# EAGLE design sensore_linea (EAGLE 7.2.0)
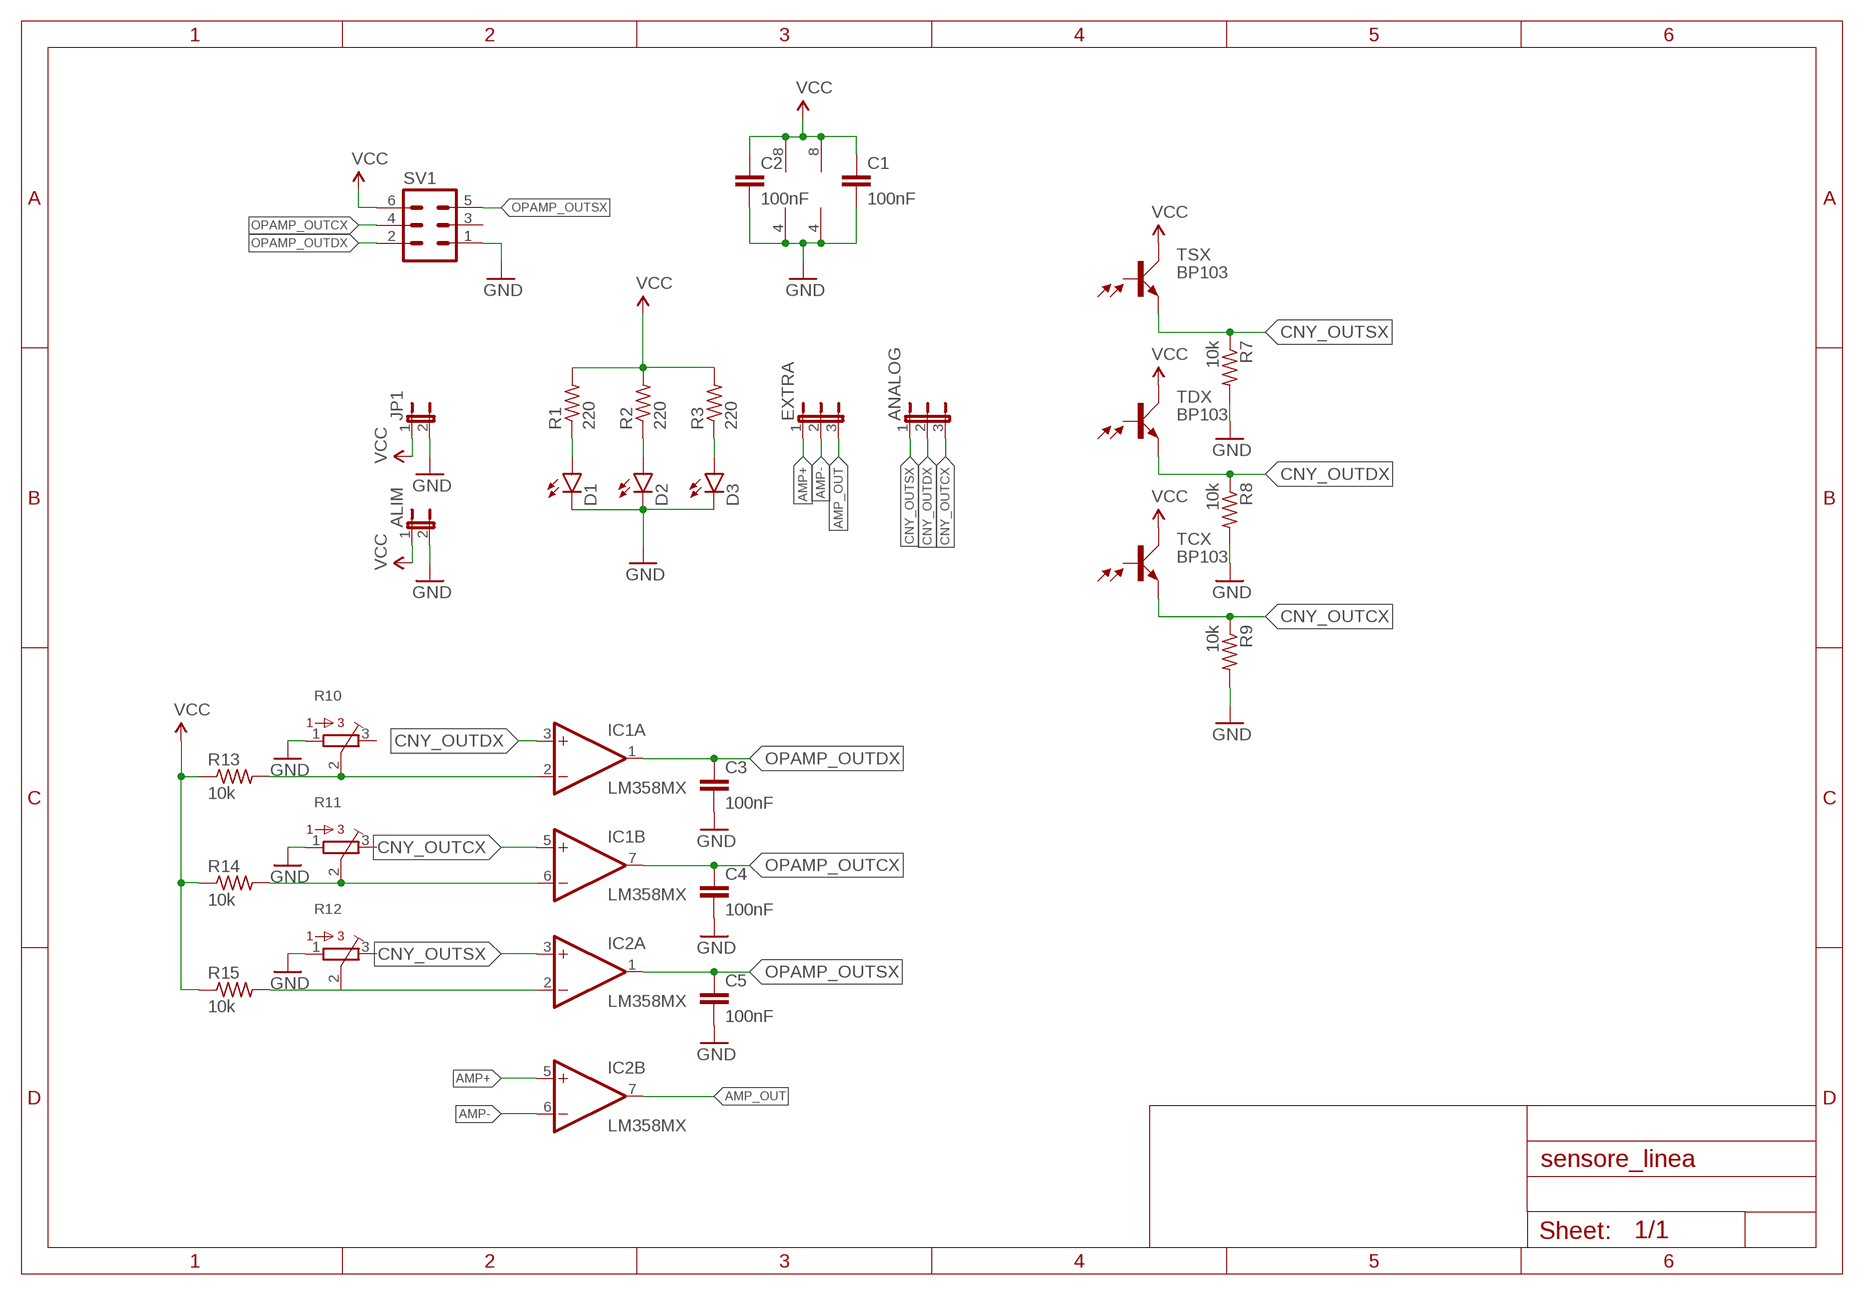
[diagram p0: schematic, sheet 1]

## Parts
ALIM  JP1E  [JP1]
ANALOG  JP2E  [JP2]
C1  100nF  C2.5/2  [C2.5-2]
C2  100nF  C2.5/2  [C2.5-2]
C3  100nF  C2.5/2  [C2.5-2]
C4  100nF  C2.5/2  [C2.5-2]
C5  100nF  C2.5/2  [C2.5-2]
D1  LED3MM  [LED3MM]
D2  LED3MM  [LED3MM]
D3  LED3MM  [LED3MM]
EXTRA  JP2E  [JP2]
IC1  LM358MX  [SO08]
IC2  LM358MX  [SO08]
JP1  JP1E  [JP1]
R1  220  R-US_0207/7  [0207/7]
R2  220  R-US_0207/7  [0207/7]
R3  220  R-US_0207/7  [0207/7]
R7  10k  R-US_0207/7  [0207/7]
R8  10k  R-US_0207/7  [0207/7]
R9  10k  R-US_0207/7  [0207/7]
R10  3386-J  [3386J]
R11  3386-J  [3386J]
R12  3386-J  [3386J]
R13  10k  R-US_0207/7  [0207/7]
R14  10k  R-US_0207/7  [0207/7]
R15  10k  R-US_0207/7  [0207/7]
SV1  MA03-2  [MA03-2]
TCX  BP103  [BP103]
TDX  BP103  [BP103]
TSX  BP103  [BP103]

## Nets
AMP+: EXTRA.1 IC2.5(B:+IN)
AMP-: EXTRA.2 IC2.6(B:-IN)
AMP_OUT: EXTRA.3 IC2.7(B:OUT)
CNY_OUTCX: ANALOG.3 IC1.5(B:+IN) R9.1 TCX.E
CNY_OUTDX: ANALOG.2 IC1.3(A:+IN) R8.1 TDX.E
CNY_OUTSX: ANALOG.1 IC2.3(A:+IN) R7.1 TSX.E
GND: ALIM.2 C1.2 C2.2 C3.2 C4.2 C5.2 D1.K(C) D2.K(C) D3.K(C) IC1.4(P:V-) IC2.4(P:V-) JP1.2 R7.2 R8.2 R9.2 R10.1 R11.1 R12.1 SV1.1
N$1: D1.A R1.1
N$2: D2.A R2.1
N$3: D3.A R3.1
N$10: IC1.2(A:-IN) R10.2 R13.2
N$11: IC1.6(B:-IN) R11.2 R14.2
N$12: IC2.2(A:-IN) R12.2 R15.2
OPAMP_OUTCX: C4.1 IC1.7(B:OUT) SV1.4
OPAMP_OUTDX: C3.1 IC1.1(A:OUT) SV1.2
OPAMP_OUTSX: C5.1 IC2.1(A:OUT) SV1.5
VCC: ALIM.1 C1.1 C2.1 IC1.8(P:V+) IC2.8(P:V+) JP1.1 R1.2 R2.2 R3.2 R13.1 R14.1 R15.1 SV1.6 TCX.C TDX.C TSX.C
Unconnected: R10.3 R11.3 R12.3 SV1.3 TCX.B TDX.B TSX.B

## Library data of the parts
ALIM JP1 = jumper:JP1E: JUMPER
ANALOG EXTRA = jumper:JP2E: JUMPER
C1-C5 = capacitor-wima:C: CAPACITOR naming: grid - package width
D1-D3 = SparkFun-LED:LED: LEDs Standard schematic elements and footprints for 5mm, 3mm, 1206, and 0603 sized LEDs. 5mm - Spark Fun Electronics SKU : COM-00529 (and others)
IC1 IC2 = linear:LM358: OP AMP also LM158; LM258; LM2904 Source: http://cache.national.com/ds/LM/LM158.pdf
R1-R3 R7-R9 R13-R15 = rcl:R-US_: RESISTOR, American symbol
R10-R12 = bourns:3386-: 3386 Series 3/8" Square Trimmer
SV1 = con-lstb:MA03-2: PIN HEADER; OC_FARNELL: unknown; OC_NEWARK: unknown
TCX TDX TSX = opto-trans-siemens:BP103: PHOTO TRANSISTOR; OC_FARNELL: unknown; OC_NEWARK: unknown

## Board
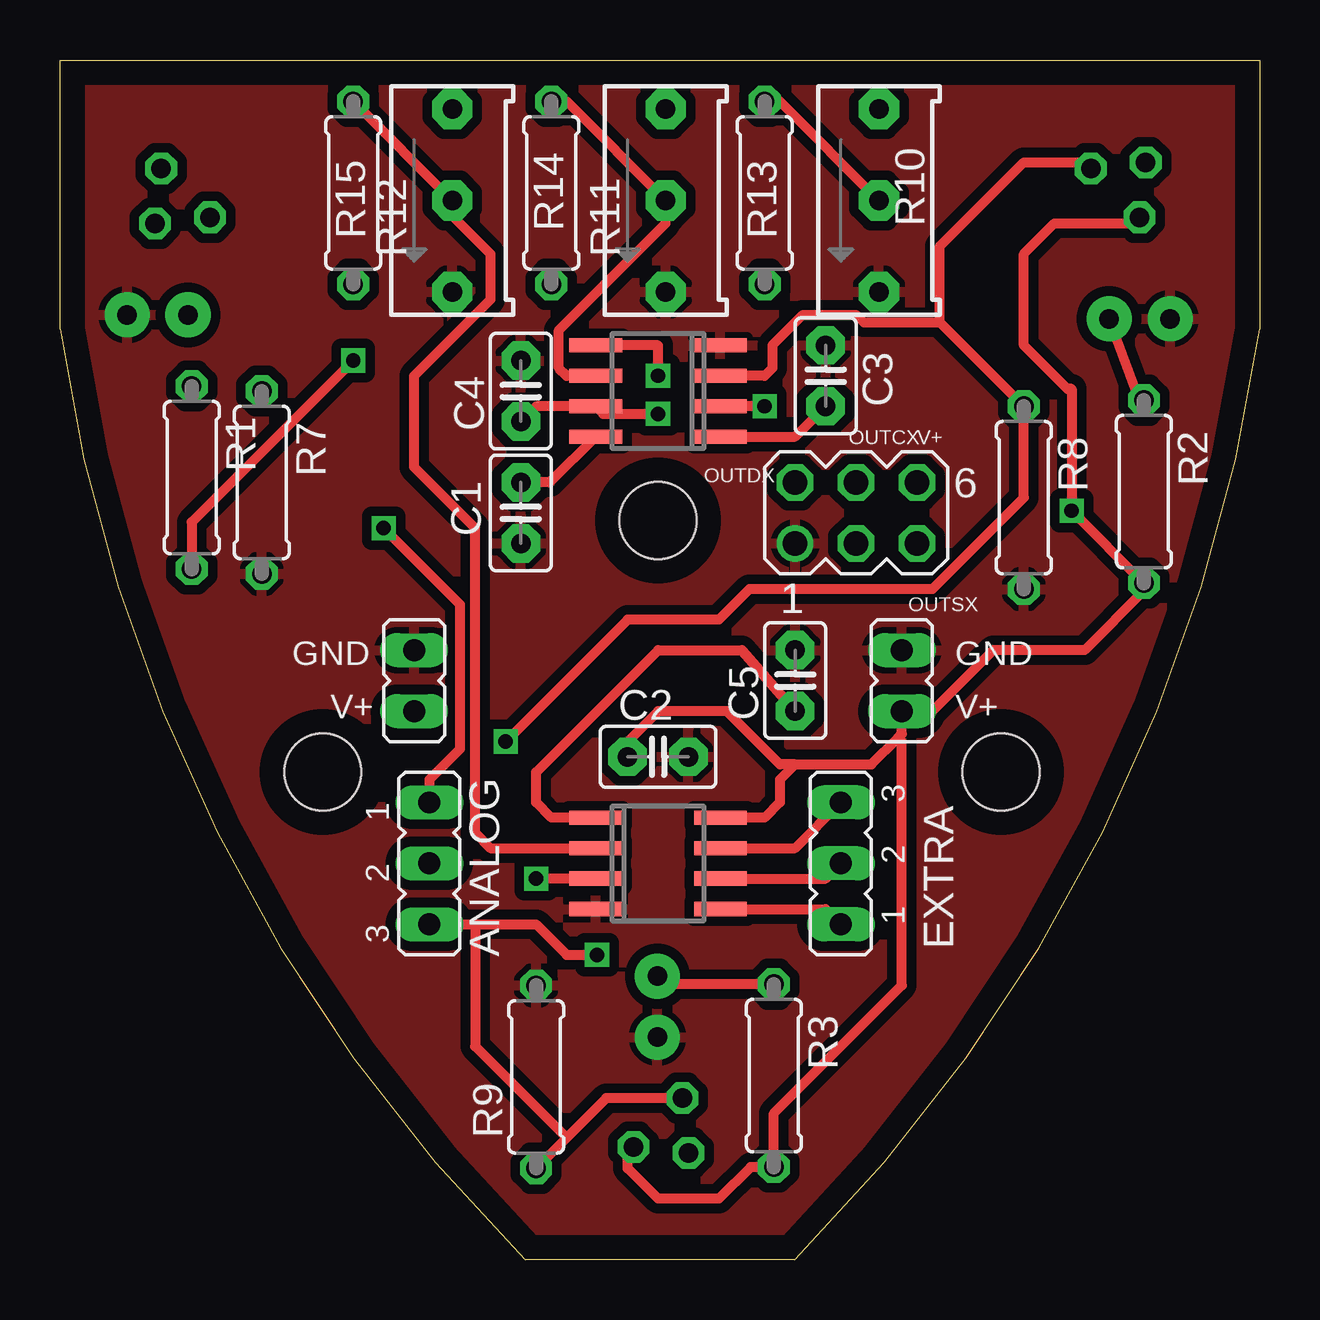
[diagram p1: board, top side]
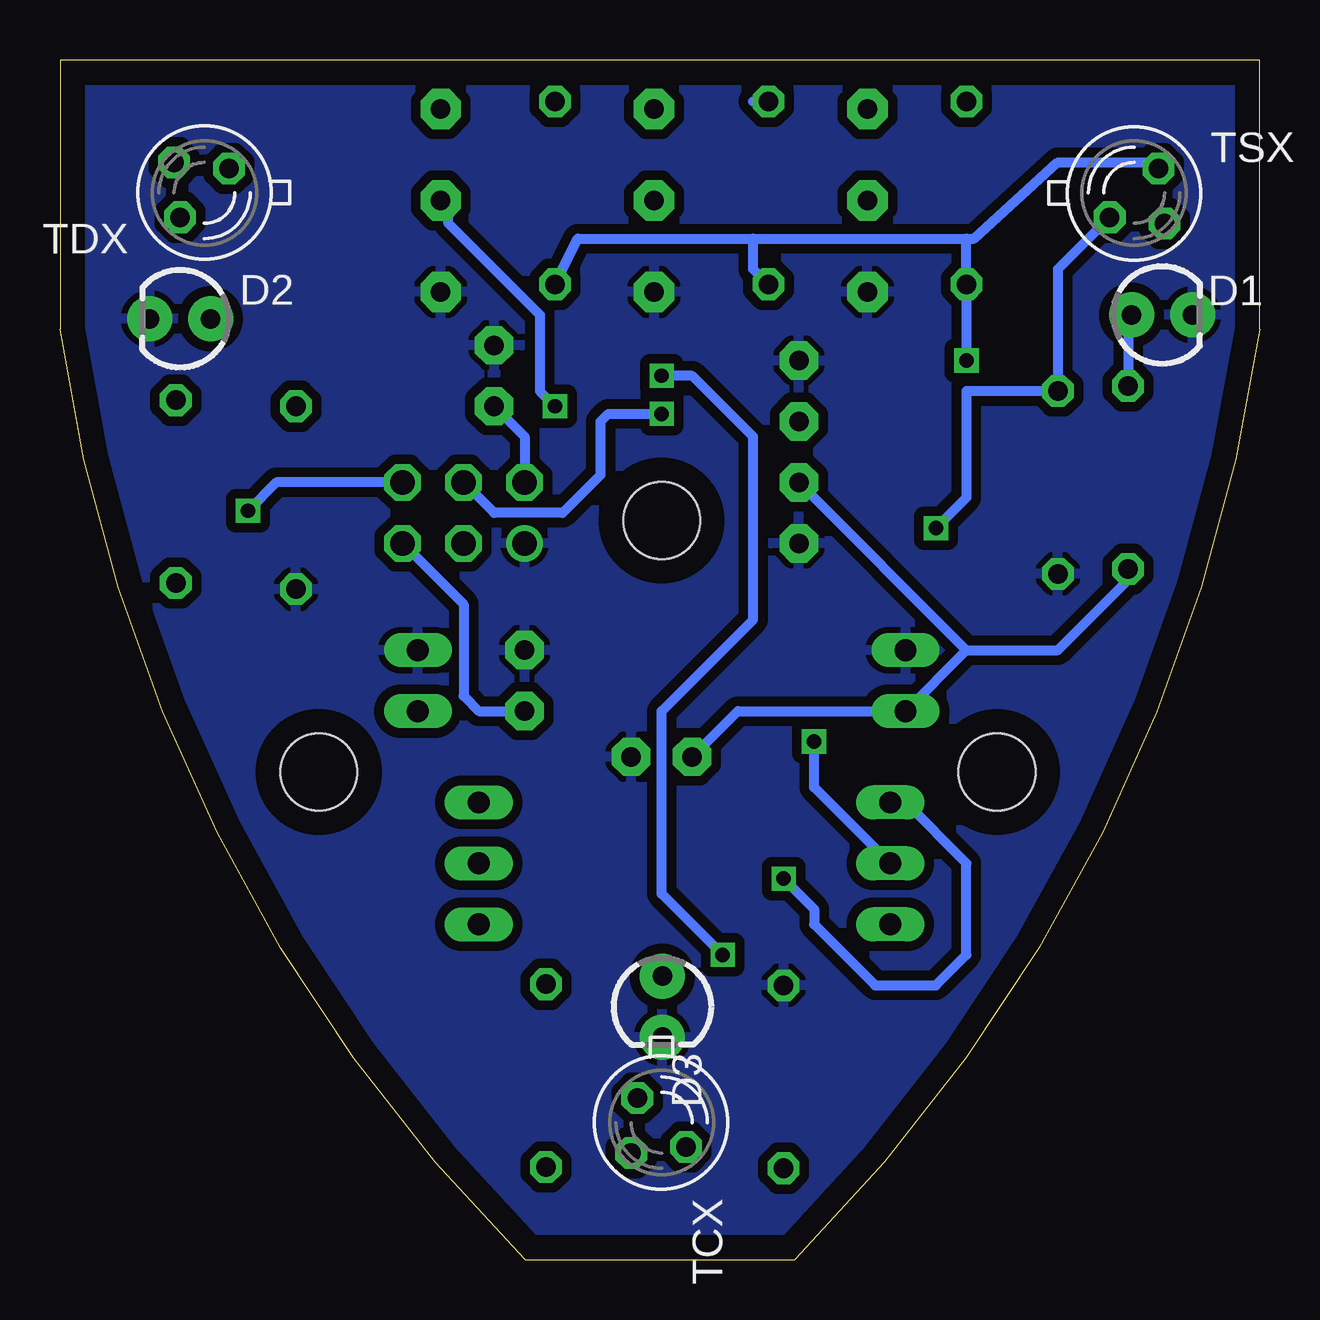
[diagram p2: board, bottom side, seen from below]

Size 49.99 x 49.99 mm. Coordinates in mm from the lower left corner, seen from the top.
Outline: 0,38.76 arc37 19.38,0 30.61,0 arc37 49.99,38.76 49.99,49.99 0,49.99 0,38.76
Copper layers (1*16): Top 0.035mm / dielectric 1.5mm / Bottom 0.035mm
Design rules "default": minimum track width 10mil, minimum drill 24mil, track to track 8mil, track to pad 8mil, pad to pad 8mil, via to via 8mil, smd to smd 8mil, copper to edge 40mil, drill to drill 8mil, minimum pad ring 10mil, minimum via ring 8mil, stop-mask expansion 4mil, vias tented up to drill 0mil, thermal gap 10mil
Holes 3.2 mm at 10.95,20.32 24.92,30.8 39.2,20.32

### Footprints (pad centres in the part's own frame; a part is rotated, then mirrored left to right if it is on the bottom)
JP1 = drill 0.914 long: 1 0,-1.27; 2 0,1.27
JP2 = drill 0.914 long: 1 -2.54,0; 2 0,0; 3 2.54,0
C2.5-2 = drill 0.813 pad 1.6 octagon: 1 -1.27,0; 2 1.27,0
LED3MM = drill 0.813 pad 1.88: A -1.27,0; K 1.27,0
SO08 = smd 0.6 x 2.2: 1 -1.905,-2.6; 2 -0.635,-2.6; 3 0.635,-2.6; 4 1.905,-2.6; 5 1.905,2.6; 6 0.635,2.6; 7 -0.635,2.6; 8 -1.905,2.6
0207/7 = drill 0.813 octagon: 1 -3.81,0; 2 3.81,0
3386J = drill 0.813 pad 1.676 octagon: 1 3.81,0.318; 2 0,0.318; 3 -3.81,0.318
MA03-2 = drill 1.016: 1 -2.54,-1.27 | drill 1.016 octagon: 2 -2.54,1.27; 3 0,-1.27; 4 0,1.27; 5 2.54,-1.27; 6 2.54,1.27
BP103 = drill 0.813 octagon: B 1.27,-1.27; C 1.016,1.016; E -1.016,-1.016

### Placement (x,y rotation side)
ALIM  14.76,24.13 0 top
ANALOG  15.39,16.51 270 top
C1  19.2,31.11 270 top
C2  24.92,20.95 0 top
C3  31.9,36.83 90 top
C4  19.2,36.2 90 top
C5  30.63,24.13 90 top
D1  4.06,39.37 0 bottom
D2  44.98,39.2 180 bottom
D3  24.89,10.54 270 bottom
EXTRA  32.54,16.51 90 top
IC1  24.92,36.2 90 top
IC2  24.92,16.51 270 top
JP1  35.08,24.13 0 top
R1  5.49,32.59 270 top
R2  45.16,32 270 top
R3  29.74,7.67 270 top
R7  8.41,32.38 270 top
R8  40.16,31.75 270 top
R9  19.84,7.62 90 top
R10  33.81,44.13 270 top
R11  24.92,44.13 270 top
R12  16.03,44.13 270 top
R13  29.36,44.45 90 top
R14  20.47,44.45 90 top
R15  12.22,44.45 90 top
SV1  33.17,31.11 0 top
TCX  24.92,5.71 270 bottom
TDX  43.97,44.45 180 bottom
TSX  5.23,44.45 0 bottom

### Tracks (layer width: path | path; a pad name or v marks a point on that pad's centre or on a via)
AMP+
  Top 0.406: IC2.5 31.9,14.61 EXTRA.1
AMP-
  Top 0.406: IC2.6 31.9,15.88 EXTRA.2
AMP_OUT
  Top 0.406: IC2.7 30.63,17.14 EXTRA.3
CNY_OUTCX  (via drill 0.6)
  Top 0.406: TCX.E 22.76,6.73 21.11,5.08 | 21.11,5.08 R9.1 | 17.3,13.97 17.3,8.89 21.11,5.08 | ANALOG.3 17.3,13.97 | 17.3,13.97 19.84,13.97 21.11,12.7 v22.38,12.7 | v24.92,36.83 24.92,38.1 IC1.5
  Bottom 0.406: v22.38,12.7 24.92,15.24 24.92,22.86 21.11,26.67 21.11,34.29 23.65,36.83 v24.92,36.83
CNY_OUTDX  (via drill 0.6)
  Top 0.406: 36.66,39.05 R8.1 40.16,31.75 36.35,27.94 28.73,27.94 27.46,26.67 23.65,26.67 v18.57,21.59 | 36.66,39.05 33.49,39.05 33.17,39.37 30.95,39.37 29.68,38.1 29.68,37.15 29.36,36.83 IC1.3 | 36.66,39.05 36.66,42.23 40.16,45.72 42.7,45.72 TDX.E
  Bottom 0.406: ANALOG.2 18.57,19.68 v18.57,21.59
CNY_OUTSX  (via drill 0.6)
  Top 0.406: v13.49,30.48 16.66,27.3 16.66,21.27 15.39,20 ANALOG.1 | IC2.3 v19.84,15.88
  Bottom 0.406: TSX.E 8.41,41.27 R7.1 12.22,36.2 12.22,31.75 v13.49,30.48 | v19.84,15.88 18.57,14.61 18.57,13.97 16.03,11.43 13.49,11.43 12.22,12.7 12.22,16.51 14.76,19.05 ANALOG.1
GND
  pour Top (isolate 0.406): -15.72,60.96 -15.72,-11.43 70.64,-11.43 70.64,60.96
  pour Bottom (isolate 0.406): -9.37,54.61 -9.37,-5.08 60.48,-5.08 60.48,54.61
N$1
  Bottom 0.406: D1.A 5.49,39.22 R1.1
N$2
  Top 0.406: D2.A 44.86,36.12 R2.1
N$3
  Top 0.406: R3.1 25.22,11.48 D3.A
N$10  (via drill 0.6)
  Top 0.406: v29.36,35.56 IC1.2 | R13.2 30,48.26 R10.2
  Bottom 0.406: v29.36,35.56 30,36.2 30,39.37 33.81,43.18 33.81,44.45 R10.2
N$11
  Top 0.406: IC1.6 21.11,36.83 20.79,37.15 20.79,38.73 25.24,43.18 R11.2 21.11,48.26 R14.2
  Bottom 0.406: R14.2 21.11,48.26
N$12
  Top 0.406: IC2.2 17.93,17.14 17.3,17.78 17.3,30.48 14.76,33.02 14.76,36.83 17.93,40.01 17.93,41.91 16.35,43.5 R12.2 R15.2
OPAMP_OUTCX  (via drill 0.6)
  Top 0.406: C4.1 19.84,35.56 IC1.7 22.63,35.24 v24.92,35.24
  Bottom 0.406: SV1.4 31.9,31.11 29.05,31.11 27.46,32.7 27.46,34.92 27.14,35.24 v24.92,35.24
OPAMP_OUTDX
  Top 0.406: IC1.1 30.63,34.29 C3.1
  Bottom 0.406: C3.1 30.63,34.29 SV1.2
OPAMP_OUTSX
  Top 0.406: IC2.1 20.47,18.41 19.84,19.05 19.84,20.32 24.92,25.4 28.41,25.4 C5.1
  Bottom 0.406: SV1.5 33.17,27.3 33.17,23.5 32.54,22.86 C5.1
VCC  (via drill 0.6)
  Top 0.406: IC1.8 20.41,32.38 C1.1 | v12.22,37.47 5.49,30.73 R1.2 | 30.63,20.64 33.81,20.64 34.92,21.75 | 34.92,21.75 35.08,21.91 JP1.1 36.35,22.86 38.89,25.4 42.7,25.4 45.16,27.86 R2.2 v42.15,31.2 42.15,36.28 41.97,36.28 40.16,38.1 40.16,41.91 41.43,43.18 44.73,43.18 TDX.C | 30.63,20.64 30,20 30,19.05 29.36,18.41 IC2.8 | 34.92,21.75 35.08,21.59 35.08,11.43 29.74,6.1 R3.2 28.78,3.86 27.46,2.54 24.92,2.54 23.65,3.81 23.65,4.45 TCX.C | 30.63,20.64 30,20.64 27.77,22.86 24.92,22.86 23.65,21.59 C2.1
  Bottom 0.406: 12.22,42.55 11.9,42.55 8.41,45.72 4.47,45.72 TSX.C | 12.22,42.55 R15.1 v12.22,37.47 | 12.22,25.4 ALIM.1 21.74,22.86 C2.1 | 12.22,25.4 8.41,25.4 5.49,28.32 R1.2 | SV1.6 40.97,32.38 v42.15,31.2 | R13.1 28.41,42.55 21.11,42.55 | 21.11,42.55 12.22,42.55 | R14.1 21.11,41.27 21.11,42.55 | C1.1 12.22,25.4

### Text on the board
tPlace: OUTCX | V+ | OUTDX | OUTSX | GND | GND | V+ | V+